# EAGLE schematic MotorPR (EAGLE 7.6.0)

## Sheet 1 of 6: LOGICA
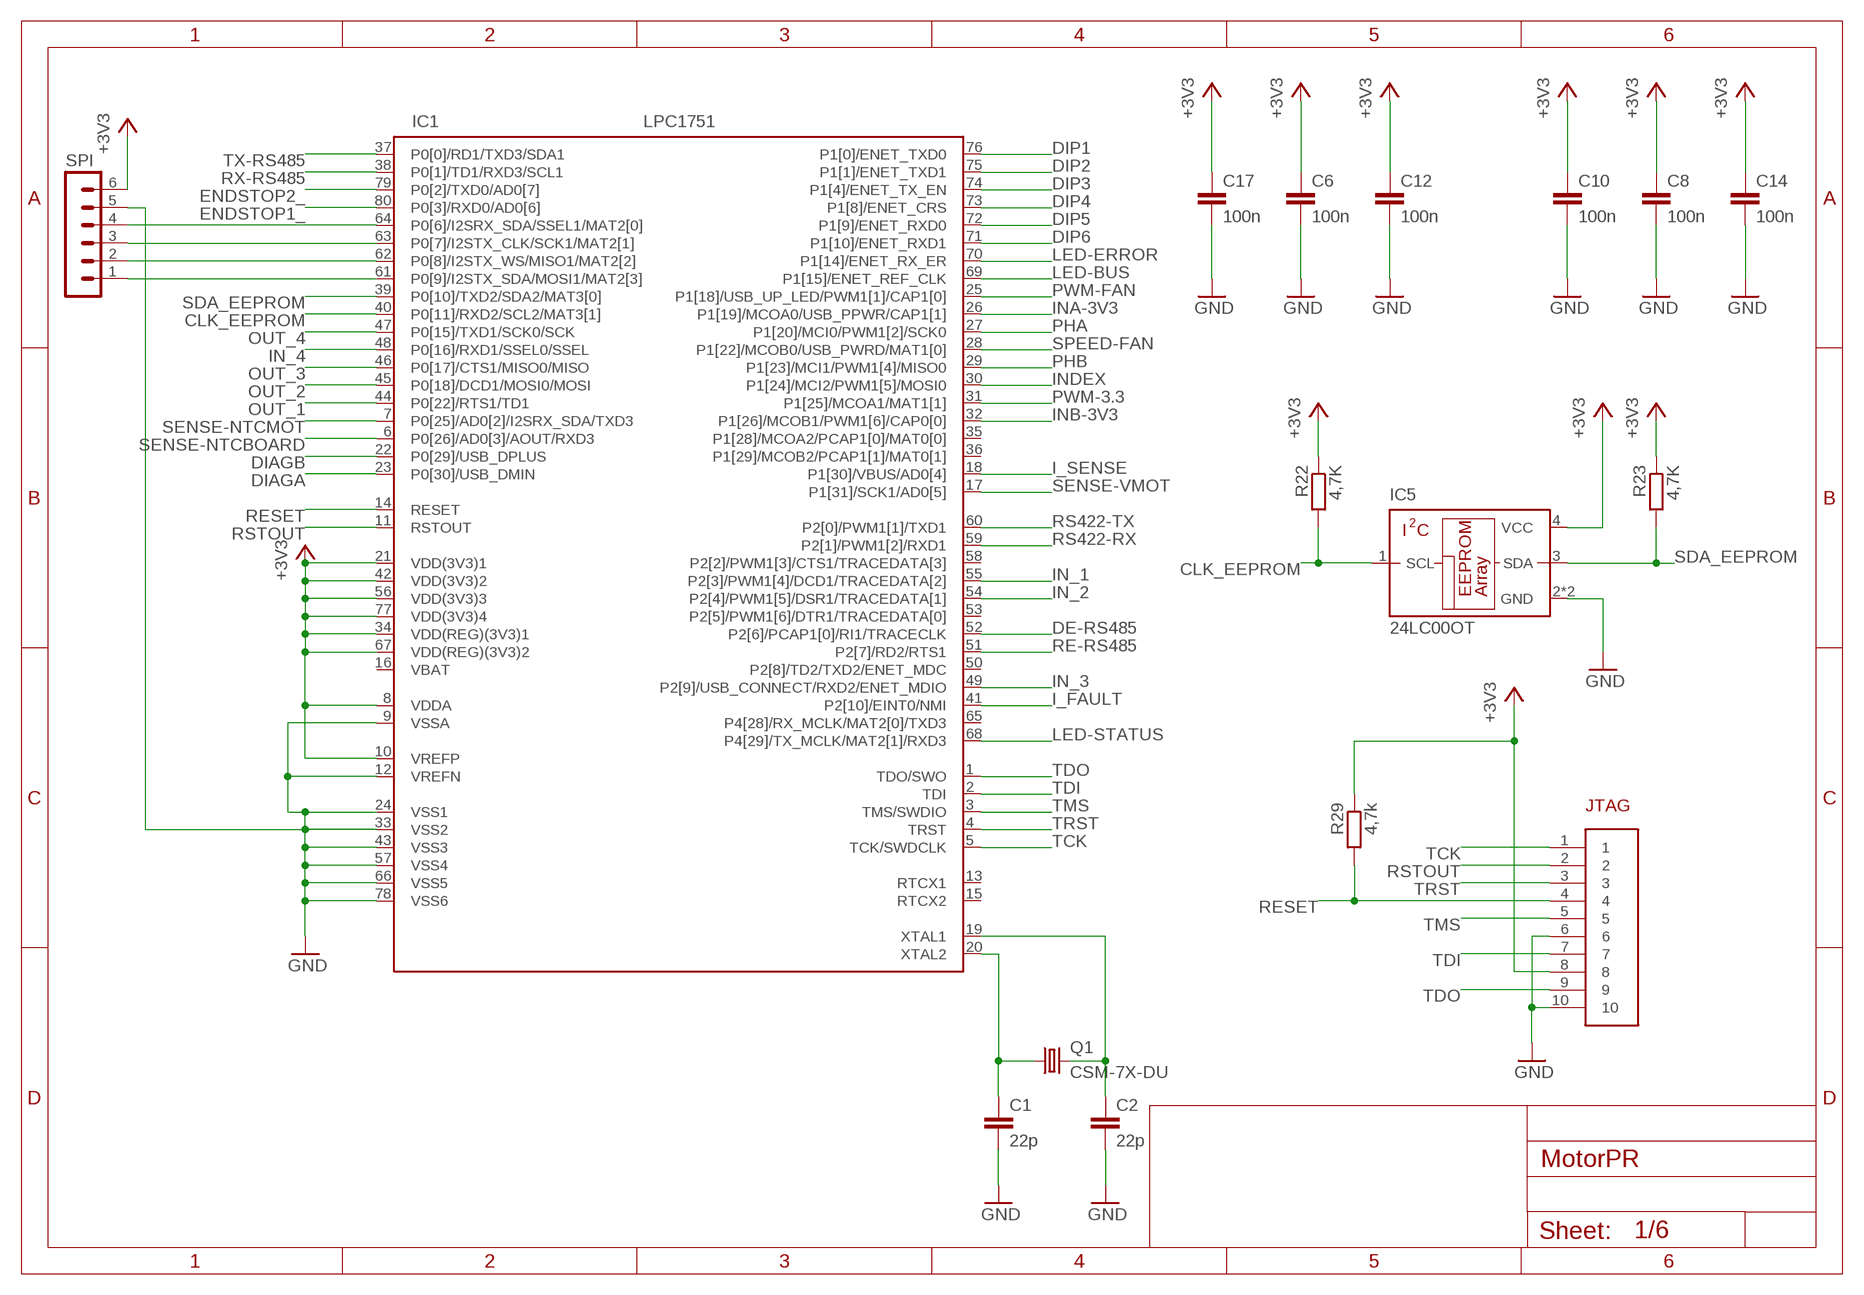
[diagram p0: schematic, sheet 1]

### Parts
C1  22p  C-EUC0805  [C0805]
C2  22p  C-EUC0805  [C0805]
C6  100n  C-EUC0805  [C0805]
C8  100n  C-EUC0805  [C0805]
C10  100n  C-EUC0805  [C0805]
C12  100n  C-EUC0805  [C0805]
C14  100n  C-EUC0805  [C0805]
C17  100n  C-EUC0805  [C0805]
IC1  LPC1751  [LQFP80-12X12]
IC5  24LC00OT  [SOT23-5L]
JTAG  MOLEX-52808-1070  [MOLEX-52808-1070]
Q1  CSM-7X-DU  [CSM-7X-DU]
R22  4,7K  R-EU_R0805W  [R0805W]
R23  4,7K  R-EU_R0805W  [R0805W]
R29  4,7k  R-EU_R0805W  [R0805W]
SPI  MA06-1  [MA06-1]

### Nets
+3V3: C6.1 C8.1 C10.1 C12.1 C14.1 C17.1 IC1.8(VDDA) IC1.10(VREFP) IC1.21(VDD(3V3)1) IC1.34(VDD(REG)(3V3)1) IC1.42(VDD(3V3)2) IC1.56(VDD(3V3)3) IC1.67(VDD(REG)(3V3)2) IC1.77(VDD(3V3)4) IC5.4(VCC) JTAG.8 R22.1 R23.1 R29.1 SPI.6 ; also sheet 2,3,4,5,6
CLK_EEPROM: IC1.40(P0[11]/RXD2/SCL2/MAT3[1]) IC5.1(SCL) R22.2
DE-RS485: IC1.52(P2[6]/PCAP1[0]/RI1/TRACECLK) ; also sheet 6
DIAGA: IC1.23(P0[30]/USB_DMIN) ; also sheet 2
DIAGB: IC1.22(P0[29]/USB_DPLUS) ; also sheet 2
DIP1: IC1.76(P1[0]/ENET_TXD0) ; also sheet 3
DIP2: IC1.75(P1[1]/ENET_TXD1) ; also sheet 3
DIP3: IC1.74(P1[4]/ENET_TX_EN) ; also sheet 3
DIP4: IC1.73(P1[8]/ENET_CRS) ; also sheet 3
DIP5: IC1.72(P1[9]/ENET_RXD0) ; also sheet 3
DIP6: IC1.71(P1[10]/ENET_RXD1) ; also sheet 3
ENDSTOP1_: IC1.80(P0[3]/RXD0/AD0[6]) ; also sheet 3
ENDSTOP2_: IC1.79(P0[2]/TXD0/AD0[7]) ; also sheet 3
GND: C1.2 C2.2 C6.2 C8.2 C10.2 C12.2 C14.2 C17.2 IC1.9(VSSA) IC1.12(VREFN) IC1.24(VSS1) IC1.33(VSS2) IC1.43(VSS3) IC1.57(VSS4) IC1.66(VSS5) IC1.78(VSS6) IC5.2(GND) IC5.5(GND) JTAG.6 JTAG.10 SPI.5 ; also sheet 2,3,4,5,6
I_FAULT: IC1.41(P2[10]/EINT0/NMI) ; also sheet 2
I_SENSE: IC1.18(P1[30]/VBUS/AD0[4]) ; also sheet 2
IN_1: IC1.55(P2[3]/PWM1[4]/DCD1/TRACEDATA[2]) ; also sheet 4
IN_2: IC1.54(P2[4]/PWM1[5]/DSR1/TRACEDATA[1]) ; also sheet 4
IN_3: IC1.49(P2[9]/USB_CONNECT/RXD2/ENET_MDIO) ; also sheet 4
IN_4: IC1.48(P0[16]/RXD1/SSEL0/SSEL) ; also sheet 4
INA-3V3: IC1.26(P1[19]/MCOA0/USB_PPWR/CAP1[1]) ; also sheet 2
INB-3V3: IC1.32(P1[26]/MCOB1/PWM1[6]/CAP0[0]) ; also sheet 2
INDEX: IC1.30(P1[24]/MCI2/PWM1[5]/MOSI0) ; also sheet 3
LED-BUS: IC1.69(P1[15]/ENET_REF_CLK) ; also sheet 3
LED-ERROR: IC1.70(P1[14]/ENET_RX_ER) ; also sheet 3
LED-STATUS: IC1.68(P4[29]/TX_MCLK/MAT2[1]/RXD3) ; also sheet 3
N$1: C2.1 IC1.19(XTAL1) Q1.2
N$2: IC1.61(P0[9]/I2STX_SDA/MOSI1/MAT2[3]) SPI.1
N$7: C1.1 IC1.20(XTAL2) Q1.1
N$23: IC1.62(P0[8]/I2STX_WS/MISO1/MAT2[2]) SPI.2
N$31: IC1.63(P0[7]/I2STX_CLK/SCK1/MAT2[1]) SPI.3
N$32: IC1.64(P0[6]/I2SRX_SDA/SSEL1/MAT2[0]) SPI.4
OUT_1: IC1.44(P0[22]/RTS1/TD1) ; also sheet 4
OUT_2: IC1.45(P0[18]/DCD1/MOSI0/MOSI) ; also sheet 4
OUT_3: IC1.46(P0[17]/CTS1/MISO0/MISO) ; also sheet 4
OUT_4: IC1.47(P0[15]/TXD1/SCK0/SCK) ; also sheet 4
PHA: IC1.27(P1[20]/MCI0/PWM1[2]/SCK0) ; also sheet 3
PHB: IC1.29(P1[23]/MCI1/PWM1[4]/MISO0) ; also sheet 3
PWM-3.3: IC1.31(P1[25]/MCOA1/MAT1[1]) ; also sheet 2
PWM-FAN: IC1.25(P1[18]/USB_UP_LED/PWM1[1]/CAP1[0]) ; also sheet 5
RE-RS485: IC1.51(P2[7]/RD2/RTS1) ; also sheet 6
RESET: IC1.14(RESET) JTAG.4 R29.2
RS422-RX: IC1.59(P2[1]/PWM1[2]/RXD1) ; also sheet 6
RS422-TX: IC1.60(P2[0]/PWM1[1]/TXD1) ; also sheet 6
RSTOUT: IC1.11(RSTOUT) JTAG.2
RX-RS485: IC1.38(P0[1]/TD1/RXD3/SCL1) ; also sheet 6
SDA_EEPROM: IC1.39(P0[10]/TXD2/SDA2/MAT3[0]) IC5.3(SDA) R23.2
SENSE-NTCBOARD: IC1.6(P0[26]/AD0[3]/AOUT/RXD3) ; also sheet 5
SENSE-NTCMOT: IC1.7(P0[25]/AD0[2]/I2SRX_SDA/TXD3) ; also sheet 5
SENSE-VMOT: IC1.17(P1[31]/SCK1/AD0[5]) ; also sheet 2
SPEED-FAN: IC1.28(P1[22]/MCOB0/USB_PWRD/MAT1[0]) ; also sheet 5
TCK: IC1.5(TCK/SWDCLK) JTAG.1
TDI: IC1.2(TDI) JTAG.7
TDO: IC1.1(TDO/SWO) JTAG.9
TMS: IC1.3(TMS/SWDIO) JTAG.5
TRST: IC1.4(TRST) JTAG.3
TX-RS485: IC1.37(P0[0]/RD1/TXD3/SDA1) ; also sheet 6
Unconnected: IC1.13(RTCX1) IC1.15(RTCX2) IC1.35(P1[28]/MCOA2/PCAP1[0]/MAT0[0]) IC1.36(P1[29]/MCOB2/PCAP1[1]/MAT0[1]) IC1.50(P2[8]/TD2/TXD2/ENET_MDC) IC1.53(P2[5]/PWM1[6]/DTR1/TRACEDATA[0]) IC1.58(P2[2]/PWM1[3]/CTS1/TRACEDATA[3]) IC1.65(P4[28]/RX_MCLK/MAT2[0]/TXD3)

## Sheet 2 of 6: POTENZA
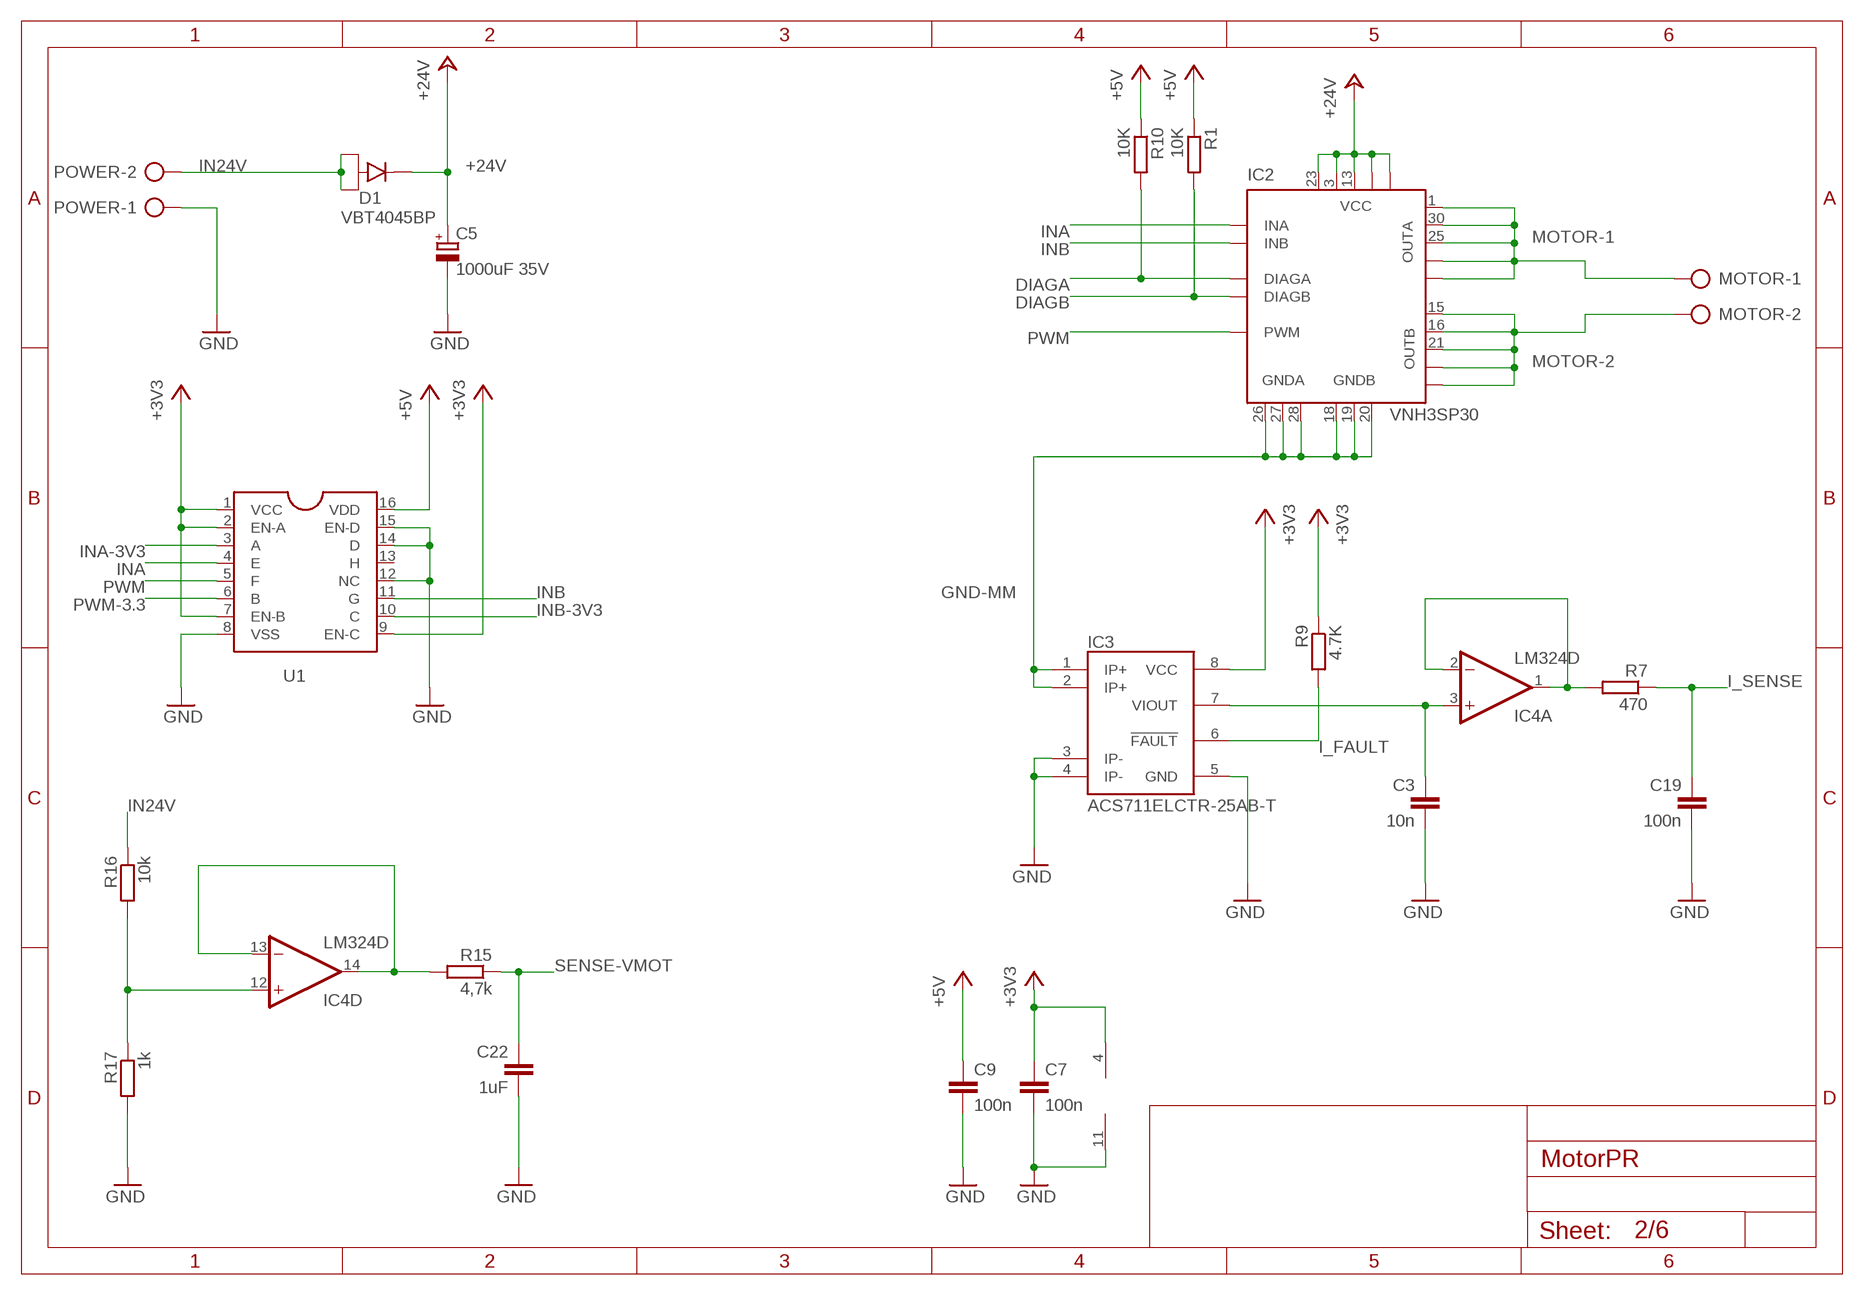
[diagram p1: schematic, sheet 2]

### Parts
C3  10n  C-EUC0805  [C0805]
C5  1000uF 35V  CPOL-EUE7.5-18  [E7,5-18]
C7  100n  C-EUC0805  [C0805]
C9  100n  C-EUC0805  [C0805]
C19  100n  C-EUC0805  [C0805]
C22  1uF  C-EUC0805  [C0805]
D1  VBT4045BP  [TO-263AB]
IC2  VNH3SP30  [MULTIPOWERSO-30]
IC3  ACS711ELCTR-25AB-T  [SO08]
IC4  LM324D  [SO14]
MOTOR  AK300/2  [AK300/2]
POWER  AK300/2  [AK300/2]
R1  10K  R-EU_R0805W  [R0805W]
R7  470  R-EU_R0805W  [R0805W]
R9  4.7K  R-EU_R0805W  [R0805W]
R10  10K  R-EU_R0805W  [R0805W]
R15  4,7k  R-EU_R0805W  [R0805W]
R16  10k  R-EU_M1206  [M1206]
R17  1k  R-EU_M1206  [M1206]
U1  CD40109B  [PW-PDSO-G16]

### Nets
+3V3: C7.1 IC3.8(VCC) IC4.4(P:V+) R9.1 U1.1(VCC) U1.2(EN-A) U1.7(EN-B) U1.9(EN-C) ; also sheet 1,3,4,5,6
+5V: C9.1 R1.1 R10.1 U1.16(VDD) ; also sheet 3,4,6
+24V: C5.+ D1.K IC2.3(VCC) IC2.13(VCC) IC2.23(VCC) IC2.VCC IC2.VCC@1(VCC)
DIAGA: IC2.6(DIAGA) R10.2 ; also sheet 1
DIAGB: IC2.10(DIAGB) R1.2 ; also sheet 1
GND: C3.2 C5.- C7.2 C9.2 C19.2 C22.2 IC3.3(IP-) IC3.4(IP-) IC3.5(GND) IC4.11(P:V-) POWER.1 R17.2 U1.8(VSS) U1.12(NC) U1.14(D) U1.15(EN-D) ; also sheet 1,3,4,5,6
GND-MM: IC2.18(GNDB) IC2.19(GNDB) IC2.20(GNDB) IC2.26(GNDA) IC2.27(GNDA) IC2.28(GNDA) IC3.1(IP+) IC3.2(IP+)
I_FAULT: IC3.6(!FAULT!) R9.2 ; also sheet 1
I_SENSE: C19.1 R7.1 ; also sheet 1
IN24V: D1.A1 D1.A2 POWER.2 R16.1 ; also sheet 3
INA: IC2.5(INA) U1.4(E)
INA-3V3: U1.3(A) ; also sheet 1
INB: IC2.11(INB) U1.11(G)
INB-3V3: U1.10(C) ; also sheet 1
MOTOR-1: IC2.1(OUTA) IC2.25(OUTA) IC2.30(OUTA) IC2.OUTA IC2.OUTA@1(OUTA) MOTOR.1
MOTOR-2: IC2.15(OUTB) IC2.16(OUTB) IC2.21(OUTB) IC2.OUTB IC2.OUTB@1(OUTB) MOTOR.2
N$15: C3.1 IC3.7(VIOUT) IC4.3(A:+IN)
N$18: IC4.13(D:-IN) IC4.14(D:OUT) R15.2
N$21: IC4.1(A:OUT) IC4.2(A:-IN) R7.2
N$22: IC4.12(D:+IN) R16.2 R17.1
PWM: IC2.8(PWM) U1.5(F)
PWM-3.3: U1.6(B) ; also sheet 1
SENSE-VMOT: C22.1 R15.1 ; also sheet 1
Unconnected: U1.13(H)

## Sheet 3 of 6: INTERFACCIA E AUSILIARI 1/2
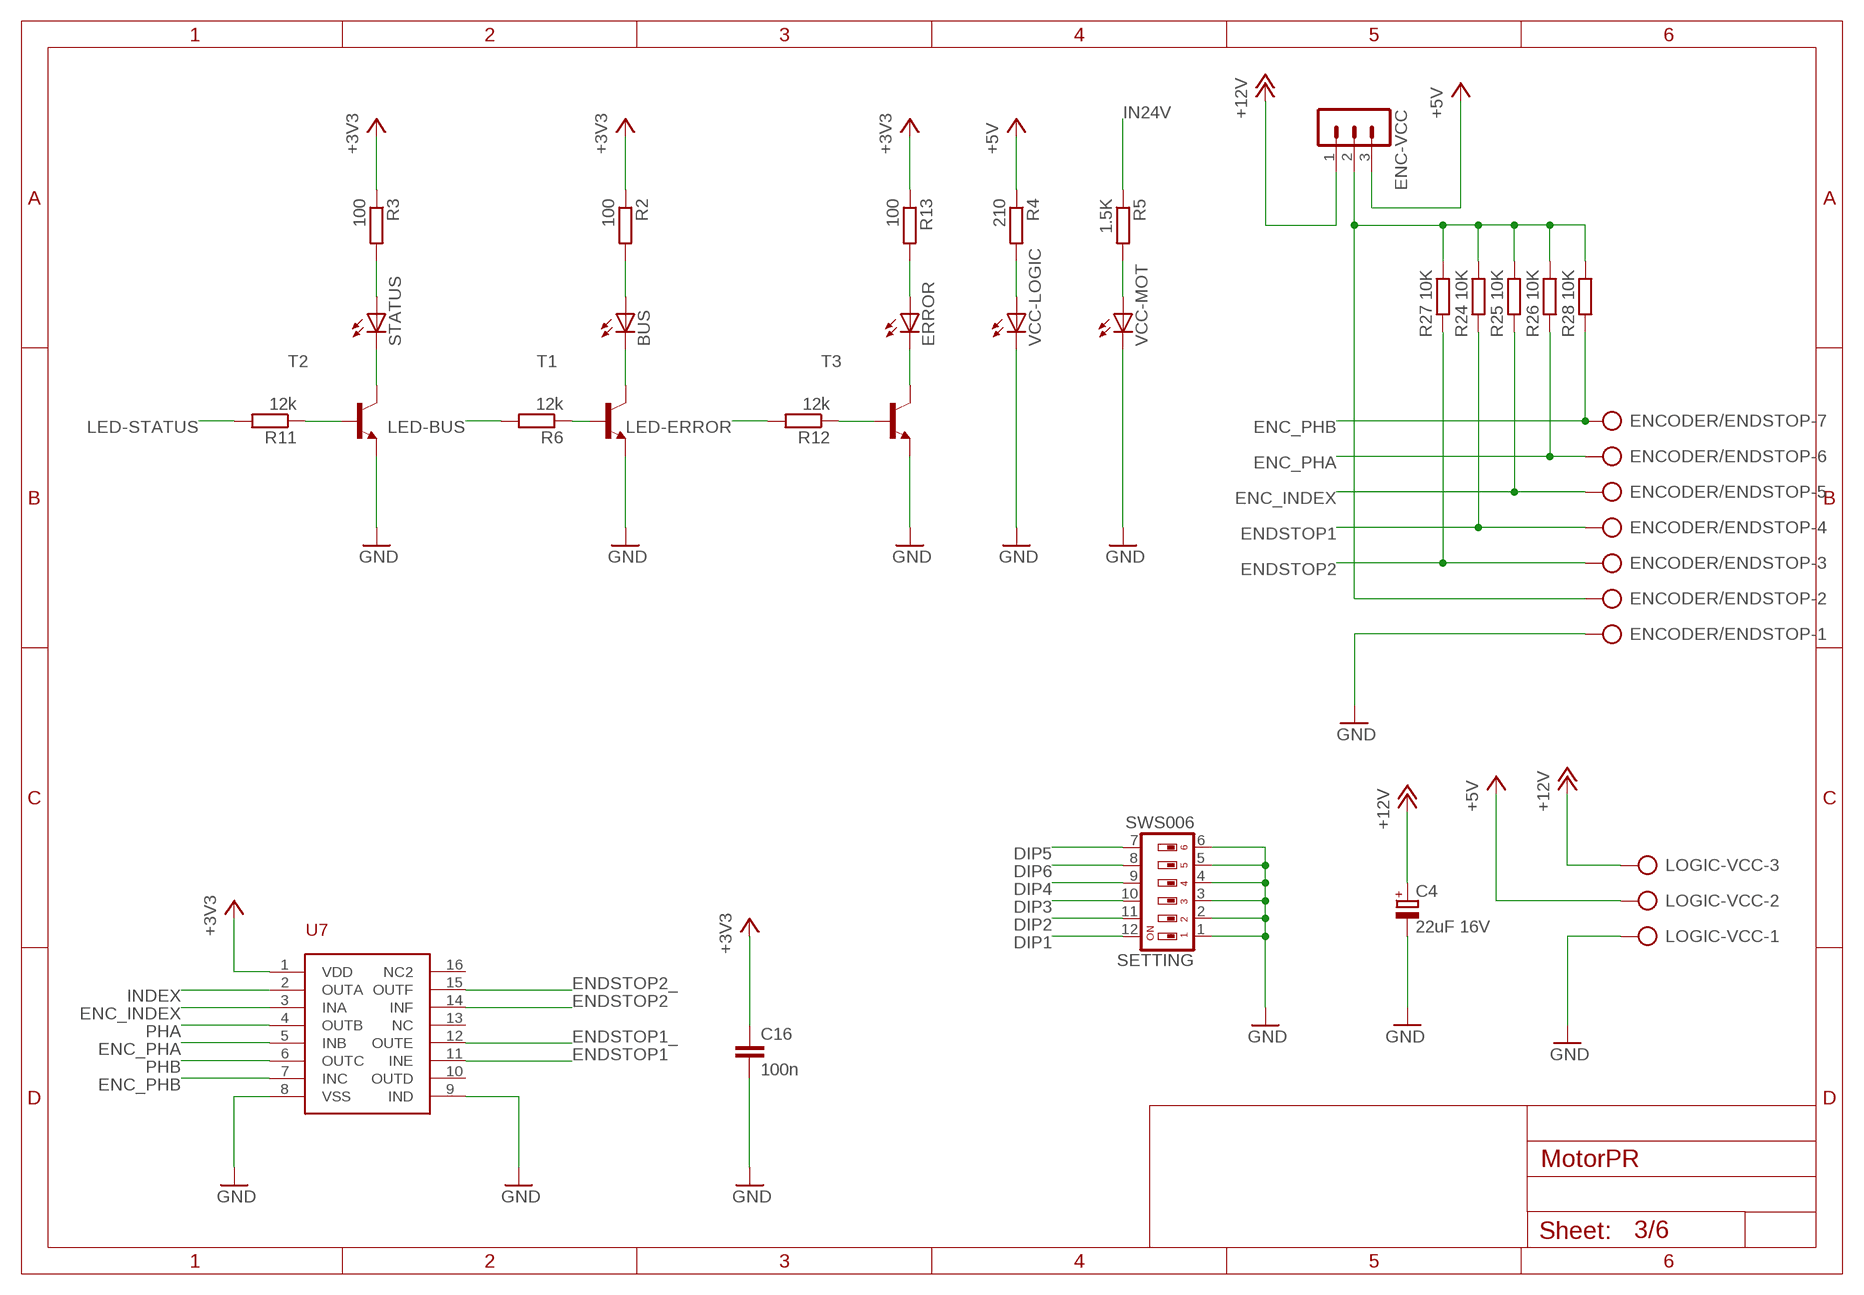
[diagram p2: schematic, sheet 3]

### Parts
BUS  LEDCHIPLED_1206  [CHIPLED_1206]
C4  22uF 16V  CPOL-EU153CLV-0605  [153CLV-0605]
C16  100n  C-EUC0805  [C0805]
ENC-VCC  MA03-1  [MA03-1]
ENCODER/ENDSTOP  AK300/7  [AK300/7]
ERROR  LEDCHIPLED_1206  [CHIPLED_1206]
LOGIC-VCC  AK300/3  [AK300/3]
R2  100  R-EU_R0805W  [R0805W]
R3  100  R-EU_R0805W  [R0805W]
R4  210  R-EU_R0805W  [R0805W]
R5  1.5K  R-EU_R0805W  [R0805W]
R6  12k  R-EU_R0805W  [R0805W]
R11  12k  R-EU_R0805W  [R0805W]
R12  12k  R-EU_R0805W  [R0805W]
R13  100  R-EU_R0805W  [R0805W]
R24  10K  R-EU_R0805W  [R0805W]
R25  10K  R-EU_R0805W  [R0805W]
R26  10K  R-EU_R0805W  [R0805W]
R27  10K  R-EU_R0805W  [R0805W]
R28  10K  R-EU_R0805W  [R0805W]
SETTING  SWS006  [DIP6-SMD]
STATUS  LEDCHIPLED_1206  [CHIPLED_1206]
T1  BC808-NPN-SOT23-BEC  [SOT23-BEC]
T2  BC808-NPN-SOT23-BEC  [SOT23-BEC]
T3  BC808-NPN-SOT23-BEC  [SOT23-BEC]
U7  MC14050B  [PDSO-G16]
VCC-LOGIC  LEDCHIPLED_1206  [CHIPLED_1206]
VCC-MOT  LEDCHIPLED_1206  [CHIPLED_1206]

### Nets
+3V3: C16.1 R2.1 R3.1 R13.1 U7.1(VDD) ; also sheet 1,2,4,5,6
+5V: ENC-VCC.3 LOGIC-VCC.2 R4.1 ; also sheet 2,4,6
+12V: C4.+ ENC-VCC.1 LOGIC-VCC.3 ; also sheet 4,5,6
DIP1: SETTING.12 ; also sheet 1
DIP2: SETTING.11 ; also sheet 1
DIP3: SETTING.10 ; also sheet 1
DIP4: SETTING.9 ; also sheet 1
DIP5: SETTING.7 ; also sheet 1
DIP6: SETTING.8 ; also sheet 1
ENC_INDEX: ENCODER/ENDSTOP.5 R25.2 U7.3(INA)
ENC_PHA: ENCODER/ENDSTOP.6 R26.2 U7.5(INB)
ENC_PHB: ENCODER/ENDSTOP.7 R28.2 U7.7(INC)
ENDSTOP1: ENCODER/ENDSTOP.4 R24.2 U7.11(INE)
ENDSTOP1_: U7.12(OUTE) ; also sheet 1
ENDSTOP2: ENCODER/ENDSTOP.3 R27.2 U7.14(INF)
ENDSTOP2_: U7.15(OUTF) ; also sheet 1
GND: C4.- C16.2 ENCODER/ENDSTOP.1 LOGIC-VCC.1 SETTING.1 SETTING.2 SETTING.3 SETTING.4 SETTING.5 SETTING.6 T1.E T2.E T3.E U7.8(VSS) U7.9(IND) VCC-LOGIC.C VCC-MOT.C ; also sheet 1,2,4,5,6
IN24V: R5.1 ; also sheet 2
INDEX: U7.2(OUTA) ; also sheet 1
LED-BUS: R6.2 ; also sheet 1
LED-ERROR: R12.2 ; also sheet 1
LED-STATUS: R11.2 ; also sheet 1
N$3: R6.1 T1.B
N$4: R11.1 T2.B
N$5: R12.1 T3.B
N$6: R5.2 VCC-MOT.A
N$8: R4.2 VCC-LOGIC.A
N$9: BUS.C T1.C
N$10: BUS.A R2.2
N$11: ERROR.A R13.2
N$12: ERROR.C T3.C
N$13: STATUS.C T2.C
N$14: R3.2 STATUS.A
N$24: ENC-VCC.2 ENCODER/ENDSTOP.2 R24.1 R25.1 R26.1 R27.1 R28.1
PHA: U7.4(OUTB) ; also sheet 1
PHB: U7.6(OUTC) ; also sheet 1
Unconnected: U7.10(OUTD) U7.13(NC) U7.16(NC2)

## Sheet 4 of 6: INTERFACCIA E AUSILIARI 2/2
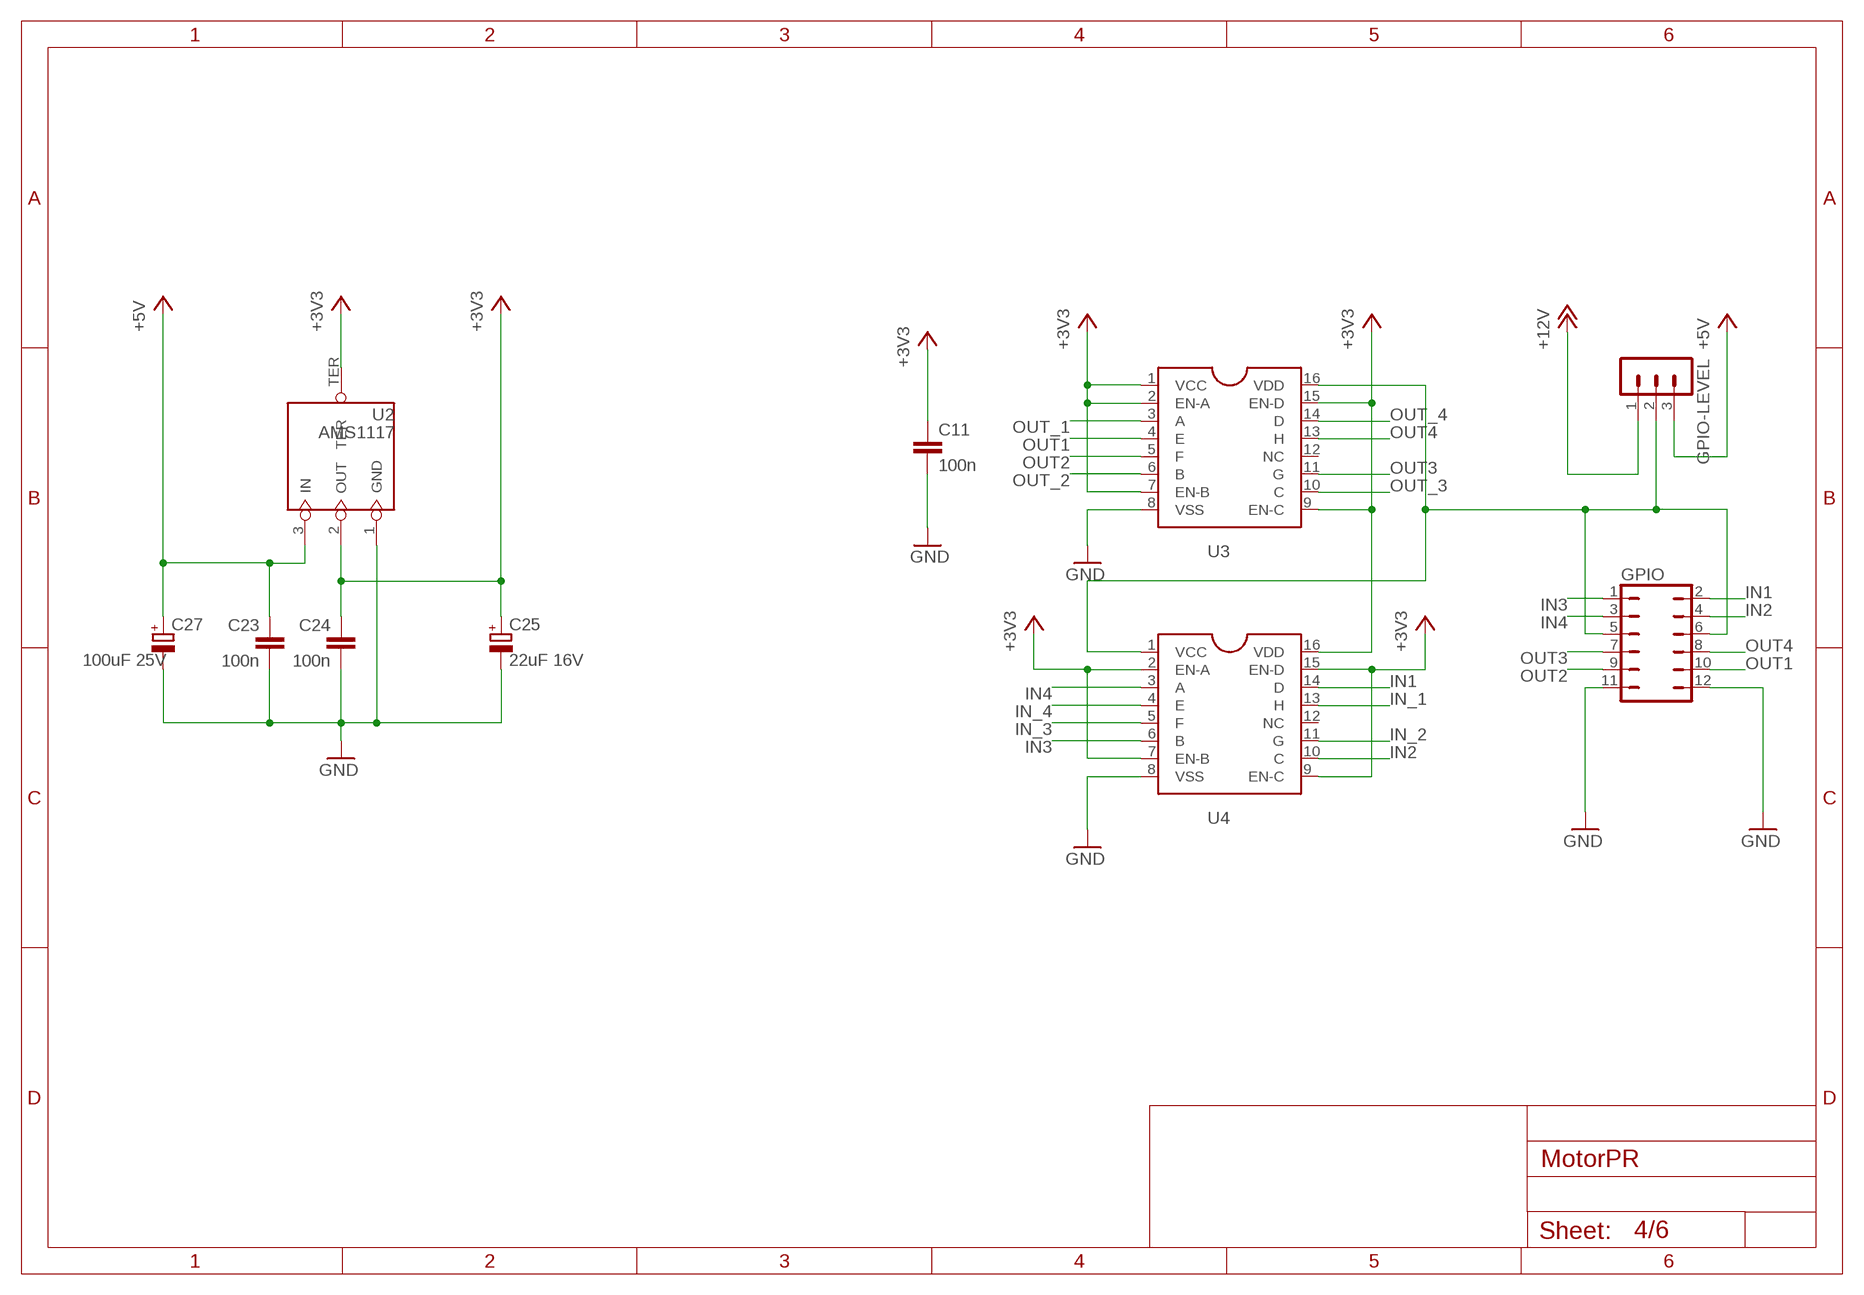
[diagram p3: schematic, sheet 4]

### Parts
C11  100n  C-EUC0805  [C0805]
C23  100n  C-EUC0805  [C0805]
C24  100n  C-EUC0805  [C0805]
C25  22uF 16V  CPOL-EU153CLV-0605  [153CLV-0605]
C27  100uF 25V  CPOL-EU153CLV-0807  [153CLV-0807]
GPIO  JP6Q  [JP6Q]
GPIO-LEVEL  MA03-1  [MA03-1]
U2  AMS1117  [SOT-223]
U3  CD40109B  [PW-PDSO-G16]
U4  CD40109B  [PW-PDSO-G16]

### Nets
+3V3: C11.1 C24.1 C25.+ U2.2(OUT) U2.TER U3.1(VCC) U3.2(EN-A) U3.7(EN-B) U3.9(EN-C) U3.15(EN-D) U4.2(EN-A) U4.7(EN-B) U4.9(EN-C) U4.15(EN-D) U4.16(VDD) ; also sheet 1,2,3,5,6
+5V: C23.1 C27.+ GPIO-LEVEL.3 U2.3(IN) ; also sheet 2,3,6
+12V: GPIO-LEVEL.1 ; also sheet 3,5,6
GND: C11.2 C23.2 C24.2 C25.- C27.- GPIO.11 GPIO.12 U2.1(GND) U3.8(VSS) U4.8(VSS) ; also sheet 1,2,3,5,6
IN1: GPIO.2 U4.14(D)
IN2: GPIO.4 U4.10(C)
IN3: GPIO.1 U4.6(B)
IN4: GPIO.3 U4.3(A)
IN_1: U4.13(H) ; also sheet 1
IN_2: U4.11(G) ; also sheet 1
IN_3: U4.5(F) ; also sheet 1
IN_4: U4.4(E) ; also sheet 1
N$36: GPIO-LEVEL.2 GPIO.5 GPIO.6 U3.16(VDD) U4.1(VCC)
OUT1: GPIO.10 U3.4(E)
OUT2: GPIO.9 U3.5(F)
OUT3: GPIO.7 U3.11(G)
OUT4: GPIO.8 U3.13(H)
OUT_1: U3.3(A) ; also sheet 1
OUT_2: U3.6(B) ; also sheet 1
OUT_3: U3.10(C) ; also sheet 1
OUT_4: U3.14(D) ; also sheet 1
Unconnected: U3.12(NC) U4.12(NC)

## Sheet 5 of 6: GESTIONE TEMPERATURA
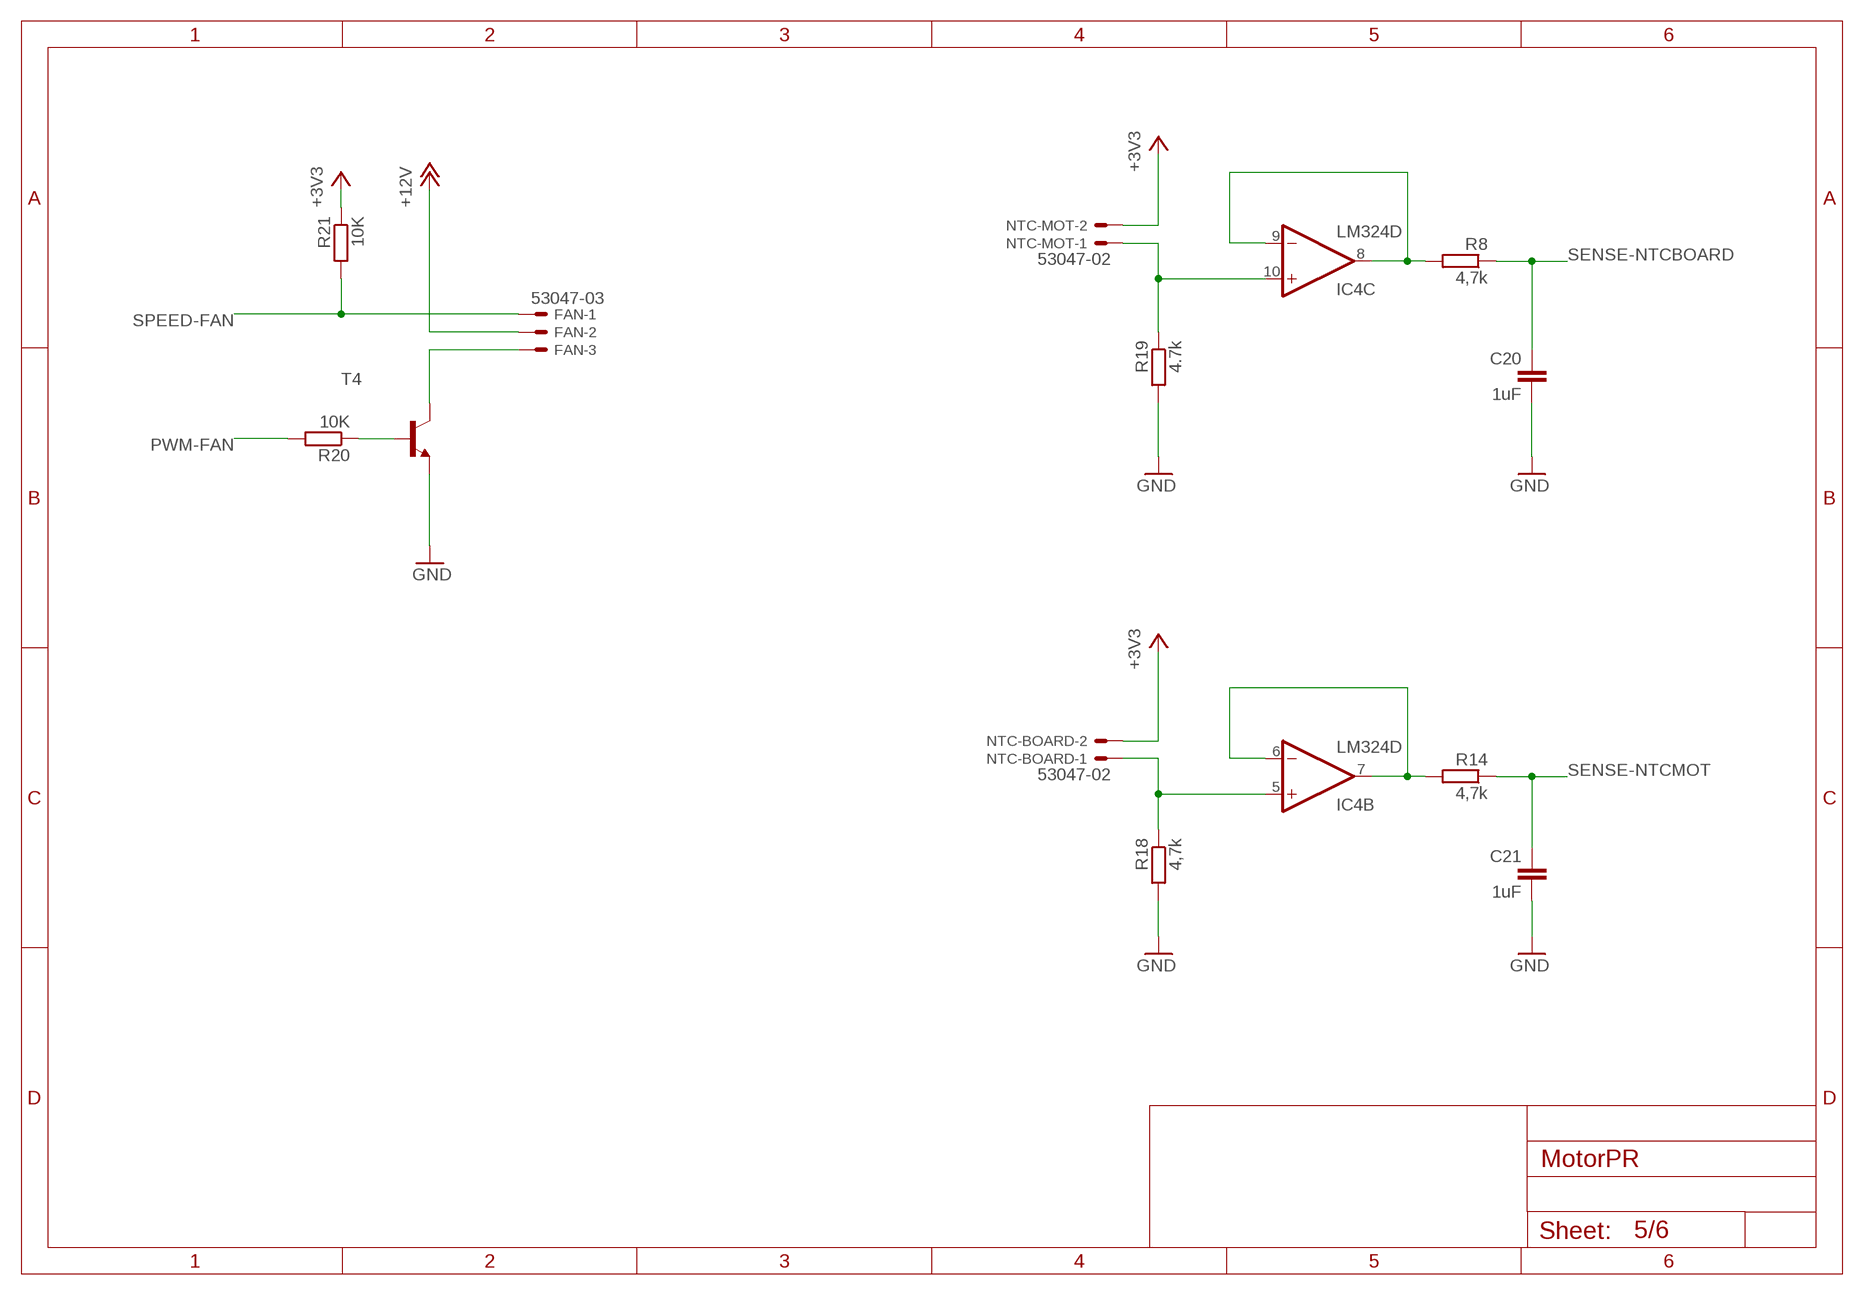
[diagram p4: schematic, sheet 5]

### Parts
C20  1uF  C-EUC0805  [C0805]
C21  1uF  C-EUC0805  [C0805]
FAN  53047-03  [53047-03]
NTC-BOARD  53047-02  [53047-02]
NTC-MOT  53047-02  [53047-02]
R8  4,7k  R-EU_R0805W  [R0805W]
R14  4,7k  R-EU_R0805W  [R0805W]
R18  4,7k  R-EU_M1206  [M1206]
R19  4.7k  R-EU_M1206  [M1206]
R20  10K  R-EU_R0805W  [R0805W]
R21  10K  R-EU_R0805W  [R0805W]
T4  BC808-NPN-SOT23-BEC  [SOT23-BEC]

### Nets
+3V3: NTC-BOARD.2 NTC-MOT.2 R21.1 ; also sheet 1,2,3,4,6
+12V: FAN.2 ; also sheet 3,4,6
GND: C20.2 C21.2 R18.2 R19.2 T4.E ; also sheet 1,2,3,4,6
N$16: IC4.8(C:OUT) IC4.9(C:-IN) R8.2
N$17: IC4.6(B:-IN) IC4.7(B:OUT) R14.2
N$19: IC4.5(B:+IN) NTC-BOARD.1 R18.1
N$20: IC4.10(C:+IN) NTC-MOT.1 R19.1
N$38: R20.1 T4.B
N$39: FAN.3 T4.C
PWM-FAN: R20.2 ; also sheet 1
SENSE-NTCBOARD: C20.1 R8.1 ; also sheet 1
SENSE-NTCMOT: C21.1 R14.1 ; also sheet 1
SPEED-FAN: FAN.1 R21.2 ; also sheet 1

## Sheet 6 of 6: COMUNICAZIONE
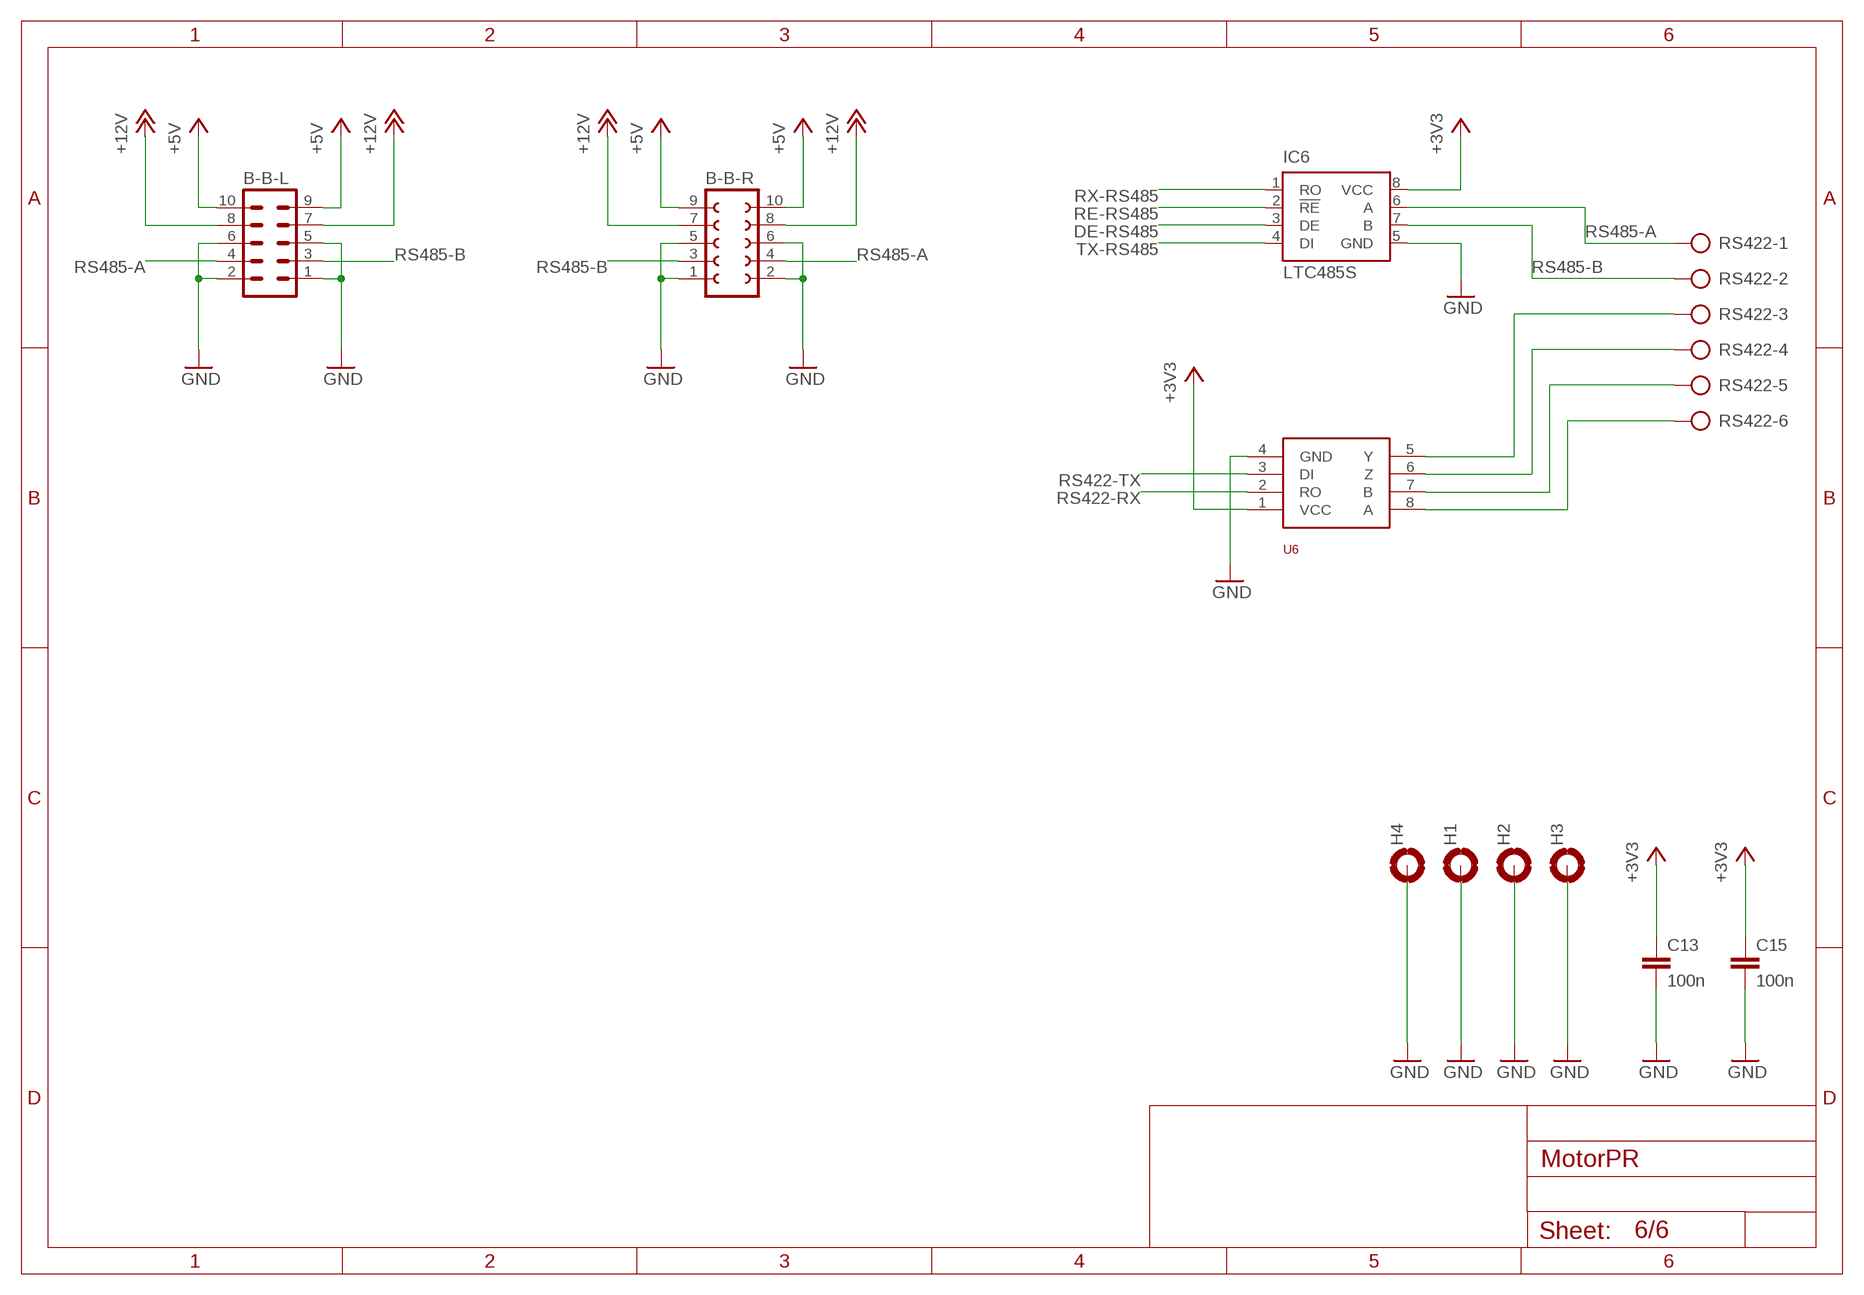
[diagram p5: schematic, sheet 6]

### Parts
B-B-L  MA05-2  [MA05-2]
B-B-R  FE05-2W  [FE05-2W]
C13  100n  C-EUC0805  [C0805]
C15  100n  C-EUC0805  [C0805]
H1  MOUNT-PAD-ROUND3.0  [3,0-PAD]
H2  MOUNT-PAD-ROUND3.0  [3,0-PAD]
H3  MOUNT-PAD-ROUND3.0  [3,0-PAD]
H4  MOUNT-PAD-ROUND3.0  [3,0-PAD]
IC6  LTC485S  [SOIC8]
RS422  AK300/6  [AK300/6]
U6  ISL83490IBZ  [R-PDSO-G8]

### Nets
+3V3: C13.1 C15.1 IC6.8(VCC) U6.1(VCC) ; also sheet 1,2,3,4,5
+5V: B-B-L.9 B-B-L.10 B-B-R.9 B-B-R.10 ; also sheet 2,3,4
+12V: B-B-L.7 B-B-L.8 B-B-R.7 B-B-R.8 ; also sheet 3,4,5
DE-RS485: IC6.3(DE) ; also sheet 1
GND: B-B-L.1 B-B-L.2 B-B-L.5 B-B-L.6 B-B-R.1 B-B-R.2 B-B-R.5 B-B-R.6 C13.2 C15.2 H1.B3,0(MOUNT) H2.B3,0(MOUNT) H3.B3,0(MOUNT) H4.B3,0(MOUNT) IC6.5(GND) U6.4(GND) ; also sheet 1,2,3,4,5
N$25: RS422.3 U6.5(Y)
N$26: RS422.4 U6.6(Z)
N$27: RS422.5 U6.7(B)
N$30: RS422.6 U6.8(A)
RE-RS485: IC6.2(!RE) ; also sheet 1
RS422-RX: U6.2(RO) ; also sheet 1
RS422-TX: U6.3(DI) ; also sheet 1
RS485-A: B-B-L.4 B-B-R.4 IC6.6(A) RS422.1
RS485-B: B-B-L.3 B-B-R.3 IC6.7(B) RS422.2
RX-RS485: IC6.1(RO) ; also sheet 1
TX-RS485: IC6.4(DI) ; also sheet 1

## Power pins joined to a net without a drawn wire
VBAT: IC1.16(VBAT)

## Library data of the parts
B-B-L = con-lstb:MA05-2: PIN HEADER; OC_FARNELL: unknown; OC_NEWARK: unknown
B-B-R = con-lsta:FE05-2W: FEMALE HEADER; OC_FARNELL: unknown; OC_NEWARK: unknown
BUS ERROR STATUS VCC-LOGIC VCC-MOT = led:LED: LED OSRAM: - CHIPLED LG R971, LG N971, LY N971, LG Q971, LY Q971, LO R971, LY R971 LH N974, LH R974 LS Q976, LO Q976, LY Q976 LO Q996 - Hyper CHIPLED LW Q18S LB Q993, LB Q99A, LB R99A - SideLED LS A670, LO A670, LY A670, LG A670, LP A670 LB A673, LV A673, LT A673, LW A673 LH A674 LY A675 LS A676, LA A676, LO A676, LY A676, LW A676 LS A679, LY A679, LG A679 - Hyper Micro SIDELED® LS Y876, LA Y876, LO Y876, LY Y876 LT Y87S - SmartLED LW L88C, LW L88S LB L89C, LB L89S, LG L890 LS L89K, LO L89K, LY L89K LS L896, LA L896, LO L896, LY L896 - TOPLED LS T670, LO T670, LY T670, LG T670, LP T670 LSG T670, LSP T670, LSY T670, LOP T670, LYG T670 LG T671, LOG T671, LSG T671 LB T673, LV T673, LT T673, LW T673 LH T674 LS T676, LA T676, LO T676, LY T676, LB T676, LH T676, LSB T676, LW T676 LB T67C, LV T67C, LT T67C, LS T67K, LO T67K, LY T67K, LW E67C LS E67B, LA E67B, LO E67B, LY E67B, LB E67C, LV E67C, LT E67C LW T67C LS T679, LY T679, LG T679 LS T770, LO T770, LY T770, LG T770, LP T770 LB T773, LV T773, LT T773, LW T773 LH T774 LS E675, LA E675, LY E675, LS T675 LS T776, LA T776, LO T776, LY T776, LB T776 LHGB T686 LT T68C, LB T68C - Hyper Mini TOPLED® LB M676 - Mini TOPLED Santana® LG M470 LS M47K, LO M47K, LY M47K Source: http://www.osram.convergy.de LUXEON: - LUMILED® LXK2-PW12-R00, LXK2-PW12-S00, LXK2-PW14-U00, LXK2-PW14-V00 LXK2-PM12-R00, LXK2-PM12-S00, LXK2-PM14-U00 LXK2-PE12-Q00, LXK2-PE12-R00, LXK2-PE12-S00, LXK2-PE14-T00, LXK2-PE14-U00 LXK2-PB12-K00, LXK2-PB12-L00, LXK2-PB12-M00, LXK2-PB14-N00, LXK2-PB14-P00, LXK2-PB14-Q00 LXK2-PR12-L00, LXK2-PR12-M00, LXK2-PR14-Q00, LXK2-PR14-R00 LXK2-PD12-Q00, LXK2-PD12-R00, LXK2-PD12-S00 LXK2-PH12-R00, LXK2-PH12-S00 LXK2-PL12-P00, LXK2-PL12-Q00, LXK2-PL12-R00 Source: www.luxeon.com KINGBRIGHT: KA-3528ASYC Source: www.kingbright.com
C1-C3 C6-C17 C19-C24 = resistor:C-EU: CAPACITOR, European symbol
C4 C5 C25 C27 = rcl:CPOL-EU: POLARIZED CAPACITOR, European symbol
D1 = StandardCustom:VBT4045BP: Trench MOS Barrier Schottky Rectifier for PV Solar Cell Bypass Protection Ultra Low VF = 0.28 V at IF = 5 A TYPICAL APPLICATIONS For use in solar cell junction box as a bypass diode for protection, using DC forward current without reverse bias. MECHANICAL DATA Case: TO-263AB Epoxy meets UL 94 V-0 flammability rating Base P/N-E3 - RoHS compliant and commercial grade Terminals: Matte tin plated leads, solderable per J-STD-002 and JESD 22-B102 E3 suffix meets JESD 201 class 1A whisker test Polarity: As marked Mounting Torque: 10 in-lbs maximum
ENC-VCC GPIO-LEVEL = con-lstb:MA03-1: PIN HEADER; OC_FARNELL: unknown; OC_NEWARK: unknown
ENCODER/ENDSTOP = con-ptr500:AK300/7: CONNECTOR; OC_FARNELL: unknown; OC_NEWARK: unknown
FAN = con-molex:53?-03: CONNECTOR wire to board 1.25 mm (.049 inch) pitch header; MPN: 530470310; OC_FARNELL: 9732853; OC_NEWARK: 14R5412
GPIO = jumper:JP6Q: JUMPER
H1-H4 = holes:MOUNT-PAD-ROUND: MOUNTING PAD, round
IC1 = lpc1xxx-v6:LPC1751: LPC1751 100 MHz 32-bit ARM Cortex-M3 based microcontroller featuring a high level of integration and low power consumption. 32 kB Flash, 8 kB SRAM, USB Device, CAN MarcVl - Datasheet available on www.nxp.com
IC2 = st-microelectronics:VNH3SP30: FULLY INTEGRATED H-BRIDGE MOTOR DRIVER Source: http://pdf1.alldatasheet.com/datasheet-pdf/view/84563/STMICROELECTRONICS/VNH3SP30.html; MPN: VNH3SP30-E; OC_FARNELL: 1739420; OC_NEWARK: 33R1486
IC3 = persAllegro:ACS711
IC4 = linear:LM324: OP AMP
IC5 = microchip:24*00: Serial EEPROM 128 bit, I2C (AA = 1.8 V/LC = 2.5 V/C = 5.0 V); MF: MICROCHIP; MPN: 24LC00T-I/OT; OC_FARNELL: 9757864; OC_NEWARK: 62K0574
IC6 = linear-technology:LTC485: Low Power RS485 Interface Transceiver Source: http://www.linear.com/pc/downloadDocument.do?navId=H0,C1,C1007,C1017,P2064,D1718; OC_FARNELL: unknown; OC_NEWARK: unknown
JTAG = StandardCustom:MOLEX-52808-1070
LOGIC-VCC = con-ptr500:AK300/3: CONNECTOR; OC_FARNELL: unknown; OC_NEWARK: unknown
MOTOR POWER = con-ptr500:AK300/2: CONNECTOR; OC_FARNELL: unknown; OC_NEWARK: unknown
NTC-BOARD NTC-MOT = con-molex:53?-02: CONNECTOR wire to board 1.25 mm (.049 inch) pitch header; MF: MOLEX; MPN: 53047-0210; OC_FARNELL: 9733051; OC_NEWARK: 57H4701
Q1 = crystal:CSM-7X-DU: SMD CRYSTAL Source: www.ecsxtal.com .. Crystal 3.6864MHz CSM_7X_DU.PDF; OC_FARNELL: unknown; OC_NEWARK: unknown
R1-R29 = resistor:R-EU_: RESISTOR, European symbol
RS422 = con-ptr500:AK300/6: CONNECTOR; OC_FARNELL: unknown; OC_NEWARK: unknown
SETTING = StandardCustom:SWS006: SMD Dip Switch 6 pol.
SPI = con-lstb:MA06-1: PIN HEADER; OC_FARNELL: unknown; OC_NEWARK: unknown
T1-T4 = transistor:*-NPN-: NPN Transistror BF959 corrected 2008.03.06
U1 U3 U4 = StandardCustom:CD40109B: Level Shifter Texas Instruments CD40109B
U2 = IC:AMS1117
U6 = StandardCustom:ISL83490IBZ
U7 = StandardCustom:MC14050B